# Altium project Schema_MaletteDevasion.PrjPcb
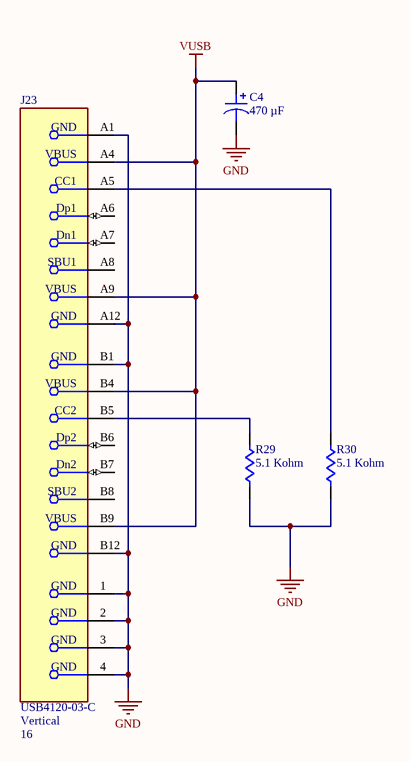
[diagram p0: Alimentation_USB_Header.SchDoc]
Projet_Concepteur1: Louis Boisvert; Projet_Concepteur2: Alexis Létourneau; Projet_Date: 2025-03-04; Projet_nom_du_cours: 247-67P-SH PROJET DE FIN D'ÉTUDES; Projet_PCB_Rev: 1; Projet_SCH_Rev: 00; Projet_stencil_Bot_epaisseur: 0.1 MM; Projet_stencil_Top_epaisseur: 0.1 MM; Projet_Titre: Mallette d'évasion
3 sheets, 58 parts. Net scope: flat (ports and power ports of the same name join across sheets).
Board files: TEMPLATE_PCB_2L.PcbDoc, MalletteV2_PCB_2L.PcbDoc
Sheets:
  Alimentation_USB_Header.SchDoc
  Énigme1_Switch.SchDoc
  Raspberry_Pi_4_ModelB.SchDoc

## Sheet Alimentation_USB_Header.SchDoc
size Tabloid; DocumentNumber: 3; SheetNumber: 3; SheetTotal: 7; Sheet_Name: Schéma_Bloc; Size: 11x17

### Parts
C4  470 µF  [CAP TH ALPOLY D10.00mm S5.00mm H13.00mm]
J23  USB4120-03-C  Orientation: Vertical  Number of Pins: 16  [FP-USB4120-03-C-MFG]
R29  5.1 Kohm  [Res_Template]
R30  5.1 Kohm  [Res_Template]

### Nets
GND: C4.2 J23.1(GND) J23.2(GND) J23.3(GND) J23.4(GND) J23.A1(GND) J23.A12(GND) J23.B1(GND) J23.B12(GND) R29.1 R30.1
VUSB: C4.1 J23.A4(VBUS) J23.A9(VBUS) J23.B4(VBUS) J23.B9(VBUS)
NetJ23_A5: J23.A5(CC1) R30.2
NetJ23_B5: J23.B5(CC2) R29.2

Not connected (* = marked no-connect by the designer): J23 A6(Dp1) A7(Dn1) A8(SBU1) B6(Dp2) B7(Dn2) B8(SBU2)

### Notes on the sheet
- Nom de la feuille
- Titre du projet
- Cours associé au projet
- Taille
- Département
- Technologies du
- Révision
- PCB
- .
- SCH
- Date
- génie électrique
- Feuille
- Variant
- de
- Concepteurs

### Library data of the parts
C4 = A759MS477M1EAAE020: CAP ALUM POLY 470UF 20% 25V T/H; manufacturer: KEMET; ESR (Equivalent Series Resistance): 20mOhm; Lifetime @ Temp.: 2000 Hrs @ 125°C; Ripple Current @ High Frequency: 4.844 A @ 100 kHz; Ripple Current @ Low Frequency: 242.2 mA @ 120 Hz; Type: Polymer; Part Number: A759MS477M1EAAE020; Value: 470 µF; Applications: General Purpose; Capacitance: 470 µF; componentlink1description: Datasheet; componentlink1url: https://api.kemet.com/component-edge/download/specsheet/A759MS477M1EAAE020.pdf; componentlink2description: DigiKey Link; componentlink2url: https://www.digikey.com/en/products/detail/kemet/A759MS477M1EAAE020/13676499; Height - Seated (Max): 0.512" (13.00mm); lastupdated: 2024-06-03 20:25:49; Lead Spacing: 0.197" (5.00mm); Lifecycle Status: Active; Minimum Order: 1; Mounting Type: Through Hole; Operating Temperature: -55°C ~ 125°C; packaging: Bulk; partid: 4689; Part Status: Active; price: 0.24; series: A759; Size / Dimension: 0.394" Dia (10.00mm); Supplier 1: DigiKey; Supplier Part Number 1: 399-A759MS477M1EAAE020-ND; Tolerance: ±20%; Voltage - Rated: 25 V
J23 = CMP-03329-113696351-1: USB4120-03-C 16 Position 48 VDC USB Type C Vertical USB 2.0 Receptacle Connector; NexarPartId: 113696351
R29 R30 = 470 ohm: Custom Semiconductor Resistor

## Sheet Énigme1_Switch.SchDoc
size Tabloid; DocumentNumber: 4; SheetNumber: 4; SheetTotal: 7; Sheet_Name: Énigme2_Interrupteur; Size: 11x17; SPICEModelCache: <root> / <DocumentId>IJWHLXDW</DocumentId> / </root>
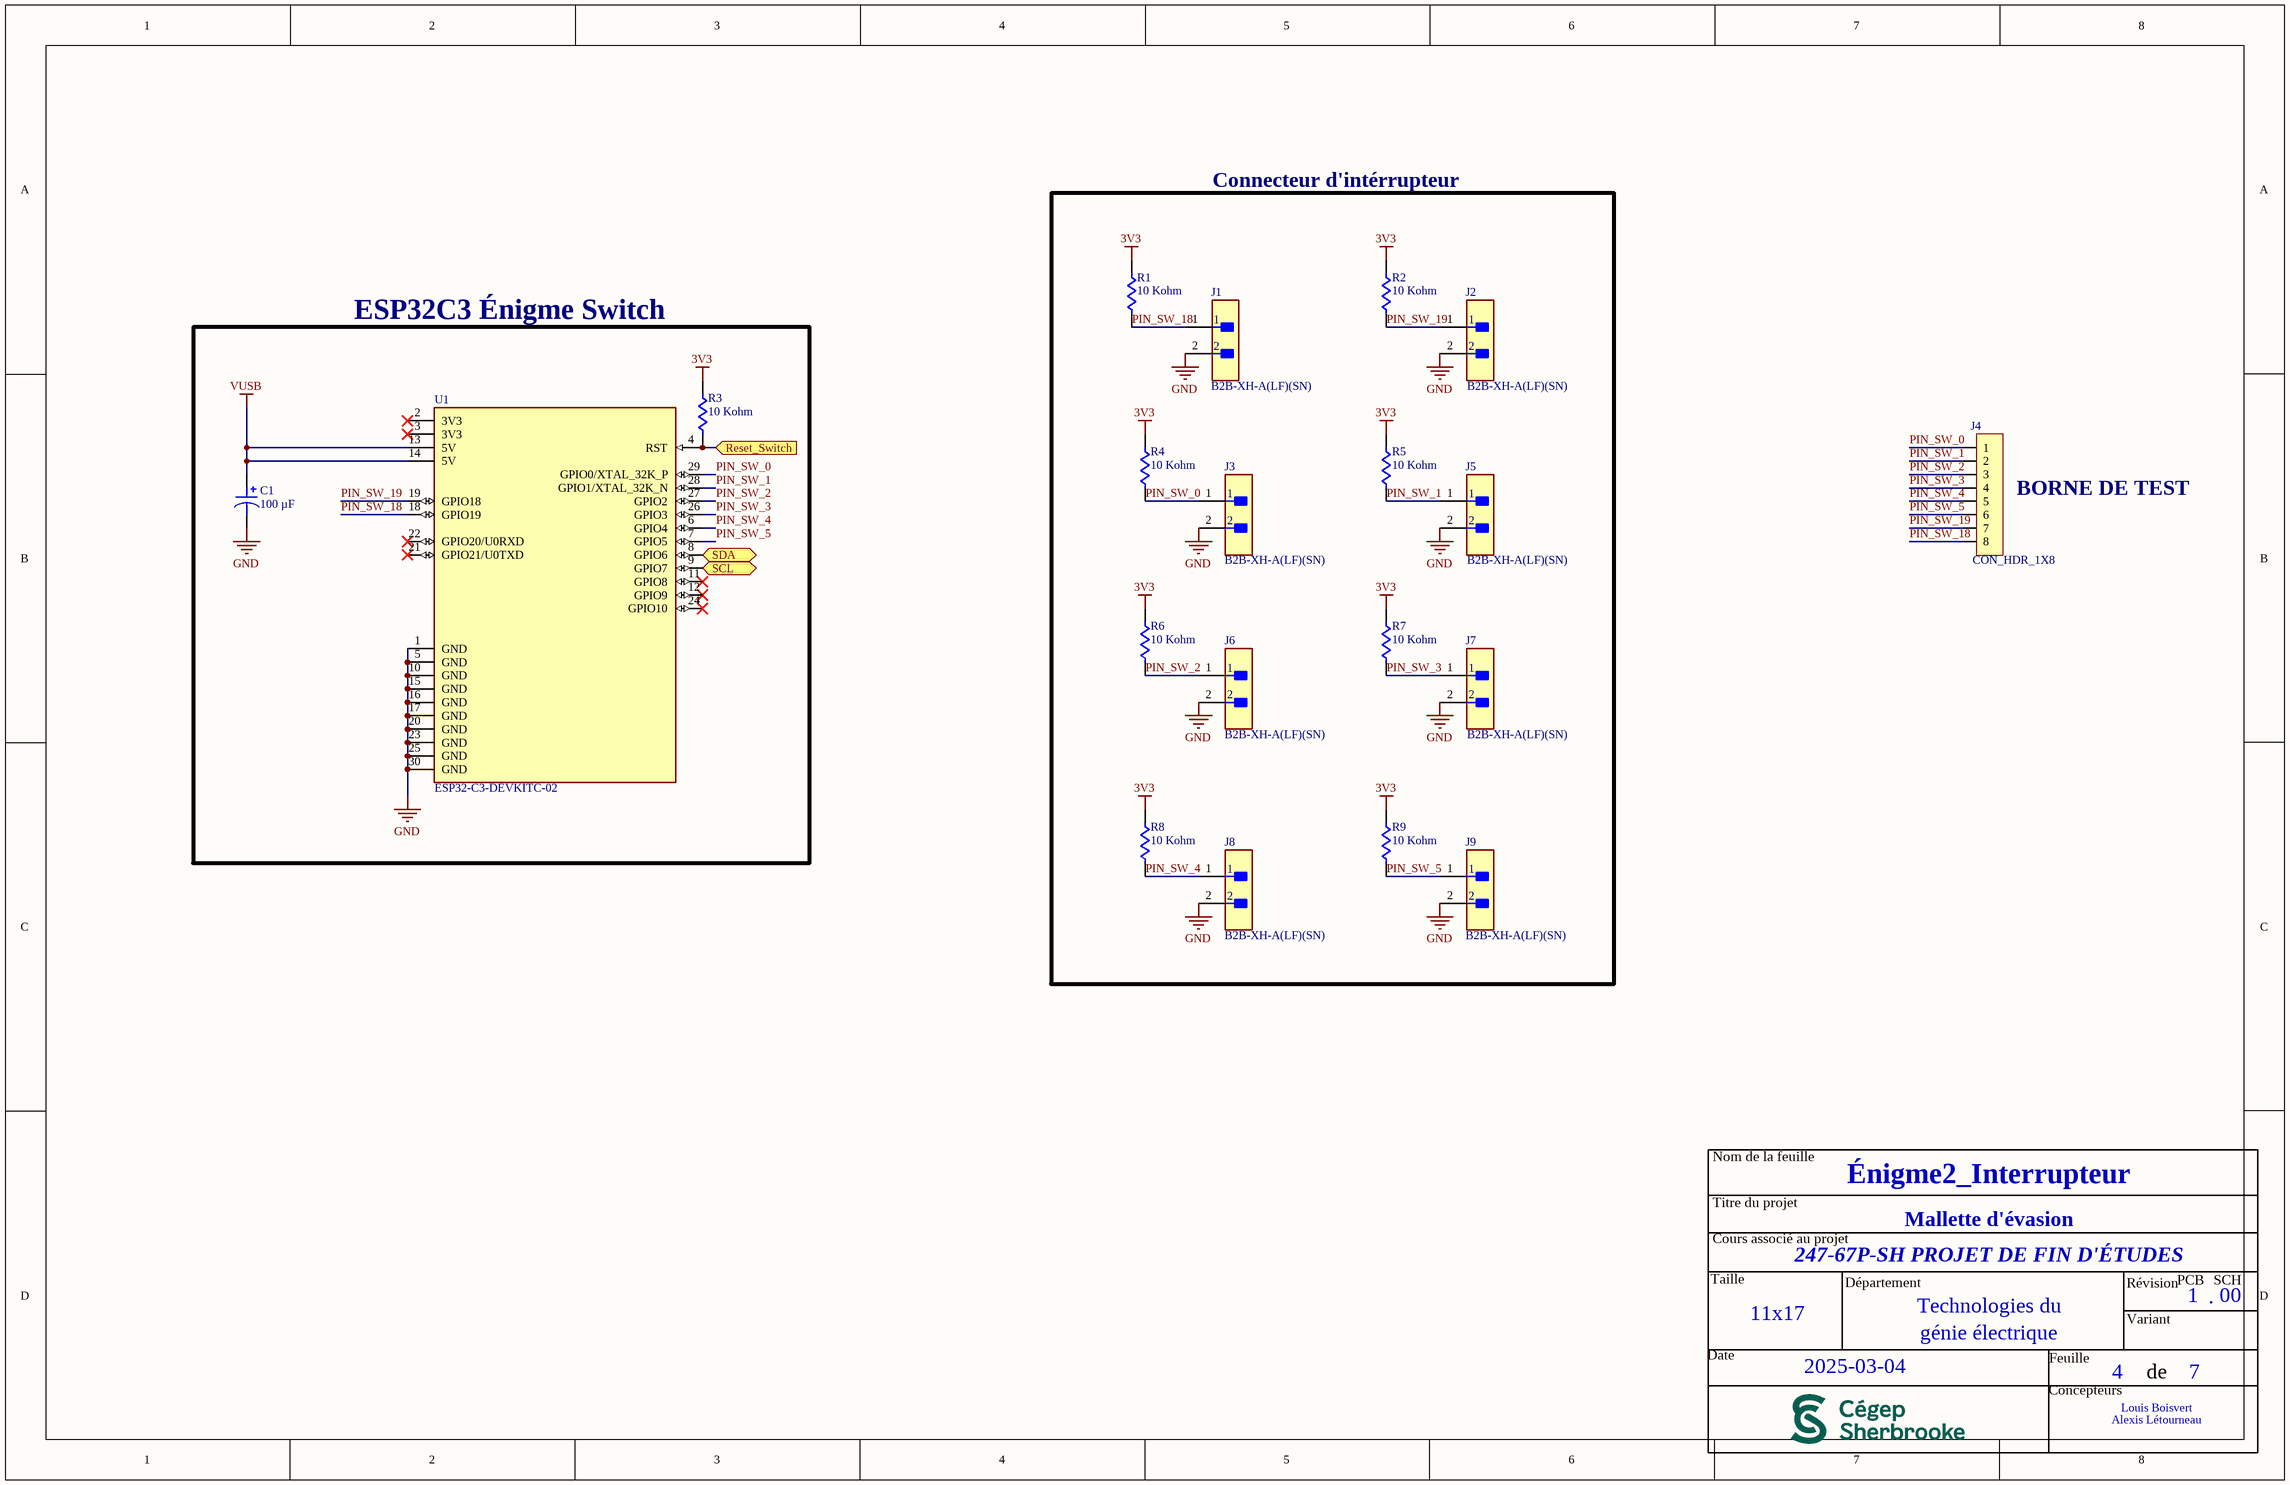
[diagram p1: Énigme1_Switch.SchDoc]

### Parts
C1  100 µF  [CAP AL TH D8 L3.5 H12.5]
J1  B2B-XH-A(LF)(SN)  [FP-B2B-XH-A_LF_SN-MFG]
J2  B2B-XH-A(LF)(SN)  [FP-B2B-XH-A_LF_SN-MFG]
J3  B2B-XH-A(LF)(SN)  [FP-B2B-XH-A_LF_SN-MFG]
J4  CON_HDR_1X8  [CON_HDR_1x8]
J5  B2B-XH-A(LF)(SN)  [FP-B2B-XH-A_LF_SN-MFG]
J6  B2B-XH-A(LF)(SN)  [FP-B2B-XH-A_LF_SN-MFG]
J7  B2B-XH-A(LF)(SN)  [FP-B2B-XH-A_LF_SN-MFG]
J8  B2B-XH-A(LF)(SN)  [FP-B2B-XH-A_LF_SN-MFG]
J9  B2B-XH-A(LF)(SN)  [FP-B2B-XH-A_LF_SN-MFG]
R1  10 Kohm  [Res_Template]
R2  10 Kohm  [Res_Template]
R3  10 Kohm  [Res_Template]
R4  10 Kohm  [Res_Template]
R5  10 Kohm  [Res_Template]
R6  10 Kohm  [Res_Template]
R7  10 Kohm  [Res_Template]
R8  10 Kohm  [Res_Template]
R9  10 Kohm  [Res_Template]
U1  ESP32-C3-DEVKITC-02  [XCVR_ESP32-C3-DEVKITC-02]

### Blocks framed on the sheet
Connecteur d'intérrupteur: J1-J3 J5-J9 R1 R2 R4-R9
ESP32C3 Énigme Switch: C1 R3 U1

### Ports
Reset_Switch (in), SCL (bidir), SDA (bidir)

### Nets
3V3: R1.2 R2.2 R3.2 R4.2 R5.2 R6.2 R7.2 R8.2 R9.2
GND: C1.2 J1.2 J2.2 J3.2 J5.2 J6.2 J7.2 J8.2 J9.2 U1.1(GND) U1.5(GND) U1.10(GND) U1.15(GND) U1.16(GND) U1.17(GND) U1.20(GND) U1.23(GND) U1.25(GND) U1.30(GND)
VUSB: C1.1 U1.13(5V) U1.14(5V)
PIN_SW_0: J3.1 J4.1 R4.1 U1.29(GPIO0/XTAL_32K_P)
PIN_SW_1: J4.2 J5.1 R5.1 U1.28(GPIO1/XTAL_32K_N)
PIN_SW_2: J4.3 J6.1 R6.1 U1.27(GPIO2)
PIN_SW_3: J4.4 J7.1 R7.1 U1.26(GPIO3)
PIN_SW_4: J4.5 J8.1 R8.1 U1.6(GPIO4)
PIN_SW_5: J4.6 J9.1 R9.1 U1.7(GPIO5)
PIN_SW_18: J1.1 J4.8 R1.1 U1.18(GPIO19)
PIN_SW_19: J2.1 J4.7 R2.1 U1.19(GPIO18)
Reset_Switch: R3.1 U1.4(RST) ; port Reset_Switch
SCL: U1.9(GPIO7) ; port SCL
SDA: U1.8(GPIO6) ; port SDA

Not connected (* = marked no-connect by the designer): U1 2(3V3)* 3(3V3)* 11(GPIO8)* 12(GPIO9)* 21(GPIO21/U0TXD)* 22(GPIO20/U0RXD)* 24(GPIO10)*

### Notes on the sheet
- (near J4) BORNE DE TEST
- Nom de la feuille
- Titre du projet
- Cours associé au projet
- Taille
- Département
- Technologies du
- Révision
- PCB
- .
- SCH
- Date
- génie électrique
- Feuille
- Variant
- de
- Concepteurs

### Library data of the parts
C1 = 860020674015: CAP ALUM 100UF 20% 50V RADIAL; manufacturer: Würth Elektronik; Lifetime @ Temp.: 2000 Hrs @ 105°C; Polarization: Polar; Ripple Current @ High Frequency: 306 mA @ 100 kHz; Ripple Current @ Low Frequency: 200 mA @ 120 Hz; Part Number: 860020674015; Applications: General Purpose; Capacitance: 100 µF; componentlink1description: Datasheet; componentlink1url: https://katalog.we-online.de/pbs/datasheet/860020674015.pdf; componentlink2description: DigiKey Link; componentlink2url: https://www.digikey.com/en/products/detail/würth-elektronik/860020674015/5727098; Device Package: Radial, Can; Height - Seated (Max): 0.492" (12.50mm); lastupdated: 2024-06-03 20:06:11; Lead Spacing: 0.138" (3.50mm); Lifecycle Status: Active; Minimum Order: 1; Mounting Type: Through Hole; Operating Temperature: -40°C ~ 105°C; Package / Case: Radial, Can; packaging: TapeAndBox; partid: 7238; Part Status: Active; price: 0.16; series: WCAP-ATG5; Size / Dimension: 0.315" Dia (8.00mm); Supplier 1: DigiKey; Supplier Part Number 1: 732-8861-1-ND; Tolerance: ±20%; value: 100 µF; Voltage - Rated: 50 V
J1-J3 J5-J9 = CMP-2000-05888-3: CONN HEADER VERT 2POS 2.5MM; Current Rating: 3A; Voltage Rating: 250V; Number of Contacts: 2; Contact Resistance: 20mR; Wire/Cable Gauge: 22AWG; Insulation Resistance: 1GR; Connector Type: Male Pin; Packaging: Bulk; Contact Material: Brass; Lead Free: Lead Free; Orientation: Straight; Contact Plating: Tin; Max Current Rating: 3A; Termination: Solder; Fastening Type: Detent; Depth: 5.75mm; Housing Material: Polyamide; REACH SVHC: No SVHC; Series: XH; Voltage Rating (AC): 250V; Number of Positions: 2; Color: Natural; Contact Type: Male Pin; Max Voltage Rating (DC): 250V; Pitch: 2.5mm; Lead Pitch: 2.5mm; Mount: Through Hole; Max Operating Temperature: 85°C; Length: 7.4mm; Max Voltage Rating (AC): 250V; Min Operating Temperature: -25°C; Number of Rows: 1; Housing Color: White
J4 = CMP-005-000004-1: CON - Header 1X8 pins, 100Mils - TH-8; Polarized: No; Note: *; Power Max: *; Component Type: Standard; Manufacturer #1: *; Design Item ID: CON_HDR_1X8; Assembly Type: TH; HelpURL: *; Pin Count: 8; Package: TH-8; Source: CEGEP_SHERBROOKE_TGE_LIBRARY.SchLib
R1-R9 = 470 ohm: Custom Semiconductor Resistor
U1 = ESP32-C3-DEVKITC-02: Development Boards & Kits - Wireless (Engineering Samples) ESP32-C3 General-Purpose Development Board, embeds ESP32-C3-WROOM-02, 4 MB Flash, with Pin Header; MF: Espressif Systems; Purchase-URL: https://www.digikey.ca/en/products/detail/espressif-systems/ESP32-C3-DEVKITC-02/14553009?gclsrc=aw.ds&&utm_adgroup=&utm_source=google&utm_medium=cpc&utm_campaign=PMax%20Product_Low%20ROAS%20Categories&utm_term=&productid=14553009&utm_content=&utm_id=go_cmp-20291741422_adg-_ad-__dev-c_ext-_prd-14553009_sig-CjwKCAiAh6y9BhBREiwApBLHC_cF2gDRygapSaJLXU2Wdnx3_ghIaBBBCKe6dQeqHq45MeITmry7OBoCG4EQAvD_BwE&gad_source=1&gclid=CjwKCAiAh6y9BhBREiwApBLHC_cF2gDRygapSaJLXU2Wdnx3_ghIaBBBCKe6dQeqHq45MeITmry7OBoCG4EQAvD_BwE; Package: None; MP: ESP32-C3-DevKitC-02; Price: 12.94$; Availability: In Stock; SnapEDA_Link: https://www.snapeda.com/parts/ESP32-C3-DevKitC-02/Espressif+Systems/view-part/?ref=snap; Check_prices: https://www.snapeda.com/parts/ESP32-C3-DevKitC-02/Espressif+Systems/view-part/?ref=eda; ComponentLink1Description: New link; ComponentLink1URL: https://docs.espressif.com/projects/esp-idf/en/v5.2/esp32c3/hw-reference/esp32c3/user-guide-devkitc-02.html

## Sheet Raspberry_Pi_4_ModelB.SchDoc
size Tabloid; Date: Date; Author: Author 1; DocumentNumber: 7; Revision: 1; SheetNumber: 7; SheetTotal: 7; Size: 11x17; Sheet_Name: Raspberry_Pi; SPICEModelCacheRTYEHROU: <root> / <DocumentId>RTYEHROU</DocumentId> / </root>
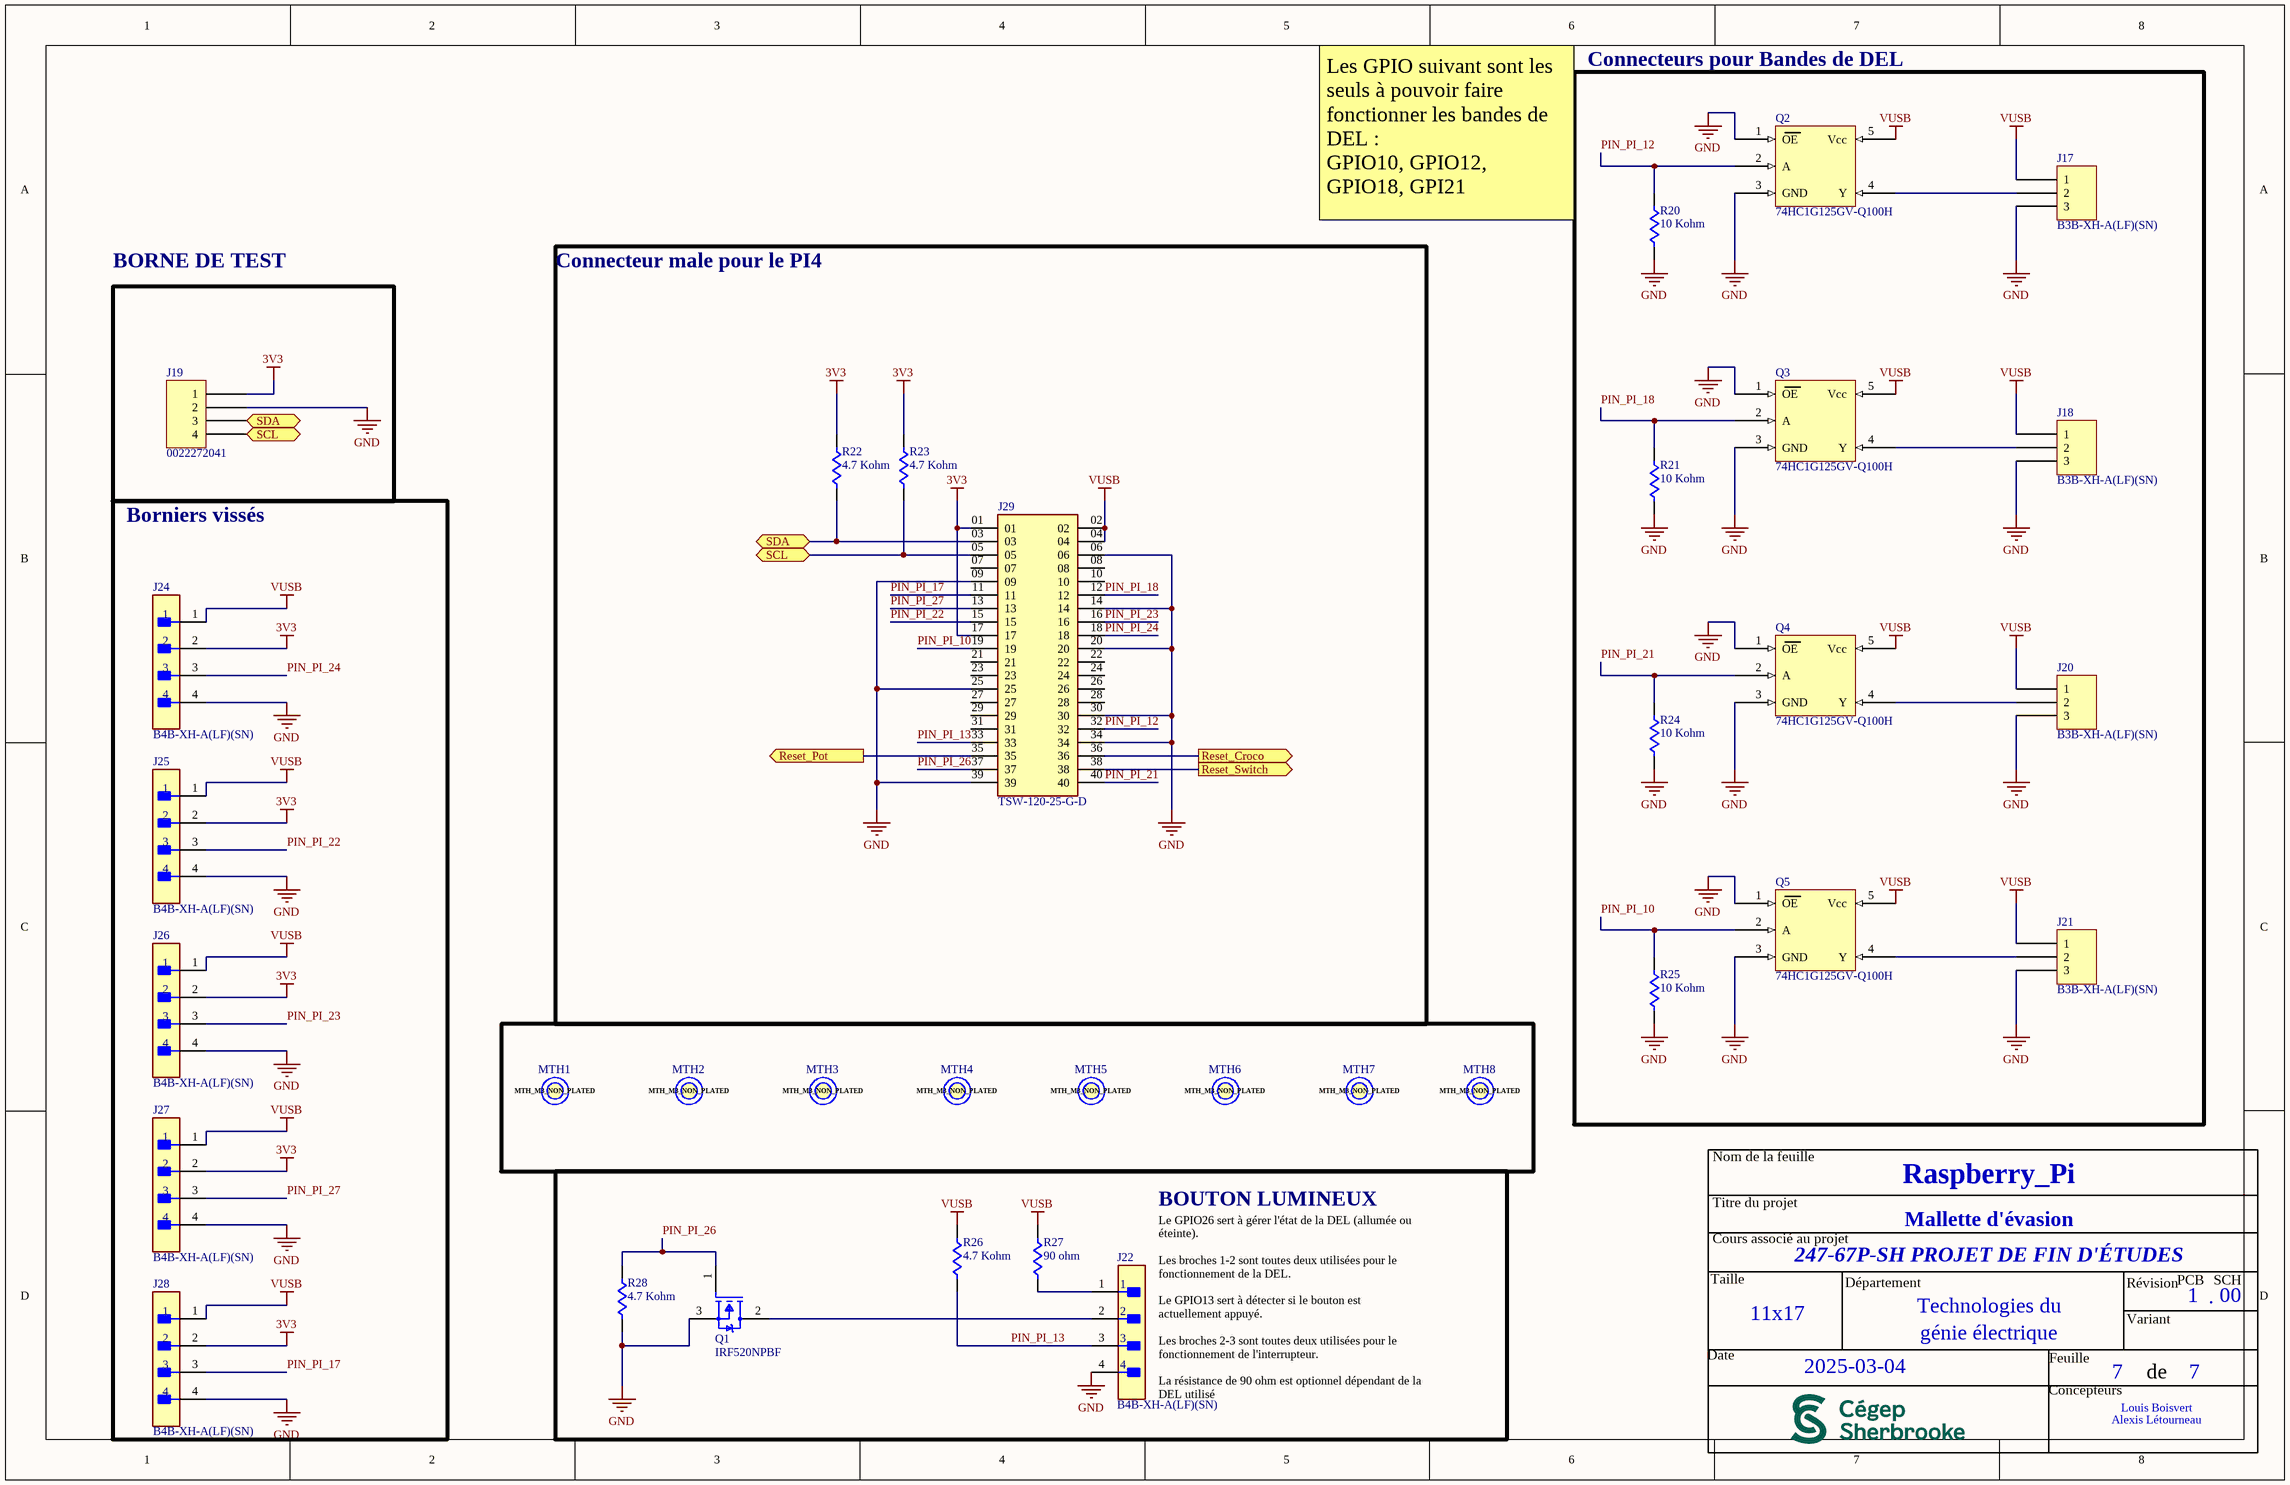
[diagram p2: Raspberry_Pi_4_ModelB.SchDoc]

### Parts
J17  B3B-XH-A(LF)(SN)  [JST XH B3B-XH-A]
J18  B3B-XH-A(LF)(SN)  [JST XH B3B-XH-A]
J19  0022272041  [MOLEX KK 0022272041]
J20  B3B-XH-A(LF)(SN)  [JST XH B3B-XH-A]
J21  B3B-XH-A(LF)(SN)  [JST XH B3B-XH-A]
J22  B4B-XH-A(LF)(SN)  [FP-B4B-XH-A_LF_SN-MFG]
J24  B4B-XH-A(LF)(SN)  [FP-B4B-XH-A_LF_SN-MFG]
J25  B4B-XH-A(LF)(SN)  [FP-B4B-XH-A_LF_SN-MFG]
J26  B4B-XH-A(LF)(SN)  [FP-B4B-XH-A_LF_SN-MFG]
J27  B4B-XH-A(LF)(SN)  [FP-B4B-XH-A_LF_SN-MFG]
J28  B4B-XH-A(LF)(SN)  [FP-B4B-XH-A_LF_SN-MFG]
J29  TSW-120-25-G-D  [SAMTEC_TSW-120-25-G-D]
MTH1  MTH_M3_NON_PLATED  [MTH_M3_NON_PLATED]  (no BOM)
MTH2  MTH_M3_NON_PLATED  [MTH_M3_NON_PLATED]  (no BOM)
MTH3  MTH_M3_NON_PLATED  [MTH_M3_NON_PLATED]  (no BOM)
MTH4  MTH_M3_NON_PLATED  [MTH_M3_NON_PLATED]  (no BOM)
MTH5  MTH_M3_NON_PLATED  [MTH_M3_NON_PLATED]  (no BOM)
MTH6  MTH_M3_NON_PLATED  [MTH_M3_NON_PLATED]  (no BOM)
MTH7  MTH_M3_NON_PLATED  [MTH_M3_NON_PLATED]  (no BOM)
MTH8  MTH_M3_NON_PLATED  [MTH_M3_NON_PLATED]  (no BOM)
Q1  IRF520NPBF  [FP-PG-TO220-3-MFG]
Q2  74HC1G125GV-Q100H  [SOT95P275X110-5N]
Q3  74HC1G125GV-Q100H  [SOT95P275X110-5N]
Q4  74HC1G125GV-Q100H  [SOT95P275X110-5N]
Q5  74HC1G125GV-Q100H  [SOT95P275X110-5N]
R20  10 Kohm  [Res_Template]
R21  10 Kohm  [Res_Template]
R22  4.7 Kohm  [Res_Template]
R23  4.7 Kohm  [Res_Template]
R24  10 Kohm  [Res_Template]
R25  10 Kohm  [Res_Template]
R26  4.7 Kohm  [Res_Template]
R27  90 ohm  [Res_Template]
R28  4.7 Kohm  [Res_Template]

### Blocks framed on the sheet
Connecteurs pour Bandes de DEL: J17 J18 J20 J21 Q2-Q5 R20 R21 R24 R25
Connecteur male pour le PI4: J29 R22 R23
BORNE DE TEST: J19
Borniers vissés: J24-J28
BOUTON LUMINEUX: J22 Q1 R26-R28

### Ports
Reset_Croco (out), Reset_Pot (out), Reset_Switch (out), SCL (bidir), SDA (bidir)

### Nets
3V3: J19.1 J24.2 J25.2 J26.2 J27.2 J28.2 J29.01 J29.17 R22.2 R23.1
GND: J17.3 J18.3 J19.2 J20.3 J21.3 J22.4 J24.4 J25.4 J26.4 J27.4 J28.4 J29.06 J29.09 J29.14 J29.20 J29.25 J29.30 J29.34 J29.39 Q1.3(S) Q2.1(OE) Q2.3(GND) Q3.1(OE) Q3.3(GND) Q4.1(OE) Q4.3(GND) Q5.1(OE) Q5.3(GND) R20.1 R21.1 R24.1 R25.1 R28.1
VUSB: J17.1 J18.1 J20.1 J21.1 J24.1 J25.1 J26.1 J27.1 J28.1 J29.02 J29.04 Q2.5(Vcc) Q3.5(Vcc) Q4.5(Vcc) Q5.5(Vcc) R26.2 R27.2
PIN_PI_10: J29.19 Q5.2(A) R25.2
PIN_PI_12: J29.32 Q2.2(A) R20.2
PIN_PI_13: J22.3 J29.33 R26.1
PIN_PI_17: J28.3 J29.11
PIN_PI_18: J29.12 Q3.2(A) R21.2
PIN_PI_21: J29.40 Q4.2(A) R24.2
PIN_PI_22: J25.3 J29.15
PIN_PI_23: J26.3 J29.16
PIN_PI_24: J24.3 J29.18
PIN_PI_26: J29.37 Q1.1(G) R28.2
PIN_PI_27: J27.3 J29.13
Reset_Croco: J29.36 ; port Reset_Croco
Reset_Pot: J29.35 ; port Reset_Pot
Reset_Switch: J29.38 ; port Reset_Switch
SCL: J19.4 J29.05 R23.2 ; port SCL
SDA: J19.3 J29.03 R22.1 ; port SDA
NetJ17_2: J17.2 Q2.4(Y)
NetJ18_2: J18.2 Q3.4(Y)
NetJ20_2: J20.2 Q4.4(Y)
NetJ21_2: J21.2 Q5.4(Y)
NetJ22_1: J22.1 R27.1
NetJ22_2: J22.2 Q1.2(D)

Not connected (* = marked no-connect by the designer): J29 07 08 10 21 22 23 24 26 27 28 29 31

### Notes on the sheet
- Les GPIO suivant sont les seuls à pouvoir faire fonctionner les bandes de DEL :
  GPIO10, GPIO12, GPIO18, GPI21
- (near J22) Le GPIO26 sert à gérer l'état de la DEL (allumée ou éteinte).
  Les broches 1-2 sont toutes deux utilisées pour le fonctionnement de la DEL.
  Le GPIO13 sert à détecter si le bouton est actuellement appuyé.
  Les broches 2-3 sont toutes deux utilisées pour le fonctionnement de l'interrupteur.
  La résistance de 90 ohm est optionnel dépendant de la DEL utilisé
- Nom de la feuille
- Titre du projet
- Cours associé au projet
- Taille
- Département
- Technologies du
- Révision
- PCB
- .
- SCH
- Date
- génie électrique
- Feuille
- Variant
- de
- Concepteurs

### Library data of the parts
J17 J18 J20 J21 = B3B-XH-A(LF)(SN): CONN HEADER VERT 3POS 2.5MM; Manufacturer: JST Sales America Inc.; Contact Length - Post: 0.134" (3.40mm); Current Rating (Amps): 3A; Material Flammability Rating: UL94 V-0; Number of Positions: 3; Number of Positions Loaded: All; Pitch - Mating: 0.098" (2.50mm); Shrouding: Shrouded - 4 Wall; Style: Board to Cable/Wire; Voltage Rating: 250V; Part Number: B3B-XH-A(LF)(SN); ComponentLink1Description: Datasheet; ComponentLink1URL: http://www.jst-mfg.com/product/pdf/eng/eXH.pdf; ComponentLink2Description: DigiKey Link; ComponentLink2URL: http://digikey.com/product-detail/en/jst-sales-america-inc/B3B-XH-A-LF-SN/455-2248-ND/1651046; Connector Type: Header; Contact Finish - Mating: Tin; Contact Finish - Post: Tin; Contact Material: Brass; Contact Shape: Square; Contact Type: Male Pin; Fastening Type: Detent Lock; Insulation Color: Natural; Insulation Height: 0.276" (7.00mm); Insulation Material: Polyamide (PA66), Nylon 6/6; LastUpdated: 2020-01-12 23:46:22; Lifecycle Status: Active; Minimum Order: 1; Mounting Type: Through Hole; Number of Rows: 1; Operating Temperature: -25°C ~ 85°C; Packaging: Bulk; PartId: 68; Part Status: Active; Price: 0.19; Series: XH; Supplier 1: DigiKey; Supplier Part Number 1: 455-2248-ND; Termination: Press-Fit, Solder
J19 = 0022272041: CONN HEADER VERT 4POS 2.54MM; Part Number: 0022272041
J22 J24-J28 = CMP-17439-000250-1: CONN HEADER VERT 4POS 2.5MM; Number of Contacts: 4; Contact Resistance: 20mR; Voltage Rating: 250V; Max Current Rating: 3A; Gender: Male; Wire/Cable Gauge: 22AWG; Mated Stacking Heights: 9.8mm; Insulation Resistance: 1GR; Orientation: Straight; Contact Type: Male Pin; Contact Finish - Mating: TIN; Series: XH; Max Voltage Rating (AC): 250V; Lead Pitch: 2.5mm; Contact Shape: Square; Insulation Color: Natural; Termination: Solder; Lead Free: Lead Free; Voltage Rating (AC): 250V; Number of Rows: 1; Flammability Rating: UL94 V-0; Number of Positions: 4; Max Operating Temperature: 85°C; Package Quantity: 500; Mount: Through Hole; REACH SVHC: No SVHC; Connector Type: Header; Insulation Material: Nylon; Fastening Type: Detent; Min Operating Temperature: -25°C; Housing Color: White; Packaging: Bulk; Contact Plating: Tin; Contact Material: Brass; Max Voltage Rating (DC): 250V; Housing Material: Polyamide; Color: Natural; Material: Polyamide; Pitch: 2.5mm; Depth: 5.75mm; Current Rating: 3A; Length: 12.4mm
MTH1-MTH8 = CMP-006-000010-2: MTH - MOUNTING HOLE M3 NON-PLATED - M3; Value: *; Component Type: Standard (No BOM); Package: M3; HelpURL: https://littlemachineshop.com/images/gallery/PDF/TapDrillSizes.pdf; Polarized: *; Pin Count: 0; Note: *; Assembly Type: NONE; Part Number #1: *; Source: CEGEP_SHERBROOKE_TGE_LIBRARY.SchLib; Design Item ID: MTH_M3_NON_PLATED; Power Max: *; Manufacturer #1: *
Q1 = CMP-32901-000276-1: MOSFET N-CH 100V 9.7A TO-220AB; Max Power Dissipation: 48W; Drain to Source Resistance: 200mR; Input Capacitance: 330pF; Gate to Source Voltage (Vgs): 20V; Element Configuration: Single; Threshold Voltage: 4V; Rise Time: 23ns; Turn-On Delay Time: 4.5ns; Turn-Off Delay Time: 32ns; Case/Package: TO-220; Power Dissipation: 48W; Drain to Source Voltage (Vdss): 100V; Continuous Drain Current (ID): 9.7A; Width: 0.185inch; Packaging: Rail/Tube; Mount: Through Hole; Max Operating Temperature: 175°C; Rds On Max: 200mR; Number of Pins: 3; Drain to Source Breakdown Voltage: 100V; Lead Free: Lead Free; Contact Plating: Tin; Height: 0.6inch; Min Operating Temperature: -55°C; RoHS Compliant: Yes; Length: 0.414inch; REACH SVHC: No SVHC; Halogen Free: Halogen Free; Max Dual Supply Voltage: 100V
Q2-Q5 = 74HC1G125GV-Q100H NXP Semiconductors: Bus Driver, HC/UH Series, 1-Func, 1-Bit, True Output, CMOS, PDSO5; Supply Voltage-Max: 6V; Supply Voltage-Min: 2V; Supply Voltage-Nominal: 5V; ComponentLink1Description: New link; ComponentLink1URL: https://www.snapeda.com/parts/74HC1G125GV-Q100H/Nexperia/view-part/?welcome=home&ref=octopart; Surface Mount: Yes
R20-R28 = 470 ohm: Custom Semiconductor Resistor
J29 = TSW-120-25-G-D: Package: None; Price: None; Value: *; MP: TSW-120-25-G-D; Availability: Unavailable

## Nets that join several sheets
3V3: Énigme1_Switch (9 pins), Raspberry_Pi_4_ModelB (10 pins)
GND: Alimentation_USB_Header (11 pins), Énigme1_Switch (19 pins), Raspberry_Pi_4_ModelB (33 pins)
VUSB: Alimentation_USB_Header (5 pins), Énigme1_Switch (C1.1 U1.13 U1.14), Raspberry_Pi_4_ModelB (17 pins)
Reset_Switch: Énigme1_Switch (R3.1 U1.4), Raspberry_Pi_4_ModelB (J29.38)
SCL: Énigme1_Switch (U1.9), Raspberry_Pi_4_ModelB (J19.4 J29.05 R23.2)
SDA: Énigme1_Switch (U1.8), Raspberry_Pi_4_ModelB (J19.3 J29.03 R22.1)